# EAGLE design Arduino_DUE_X_V02d-2Layer (EAGLE 7.1.0)
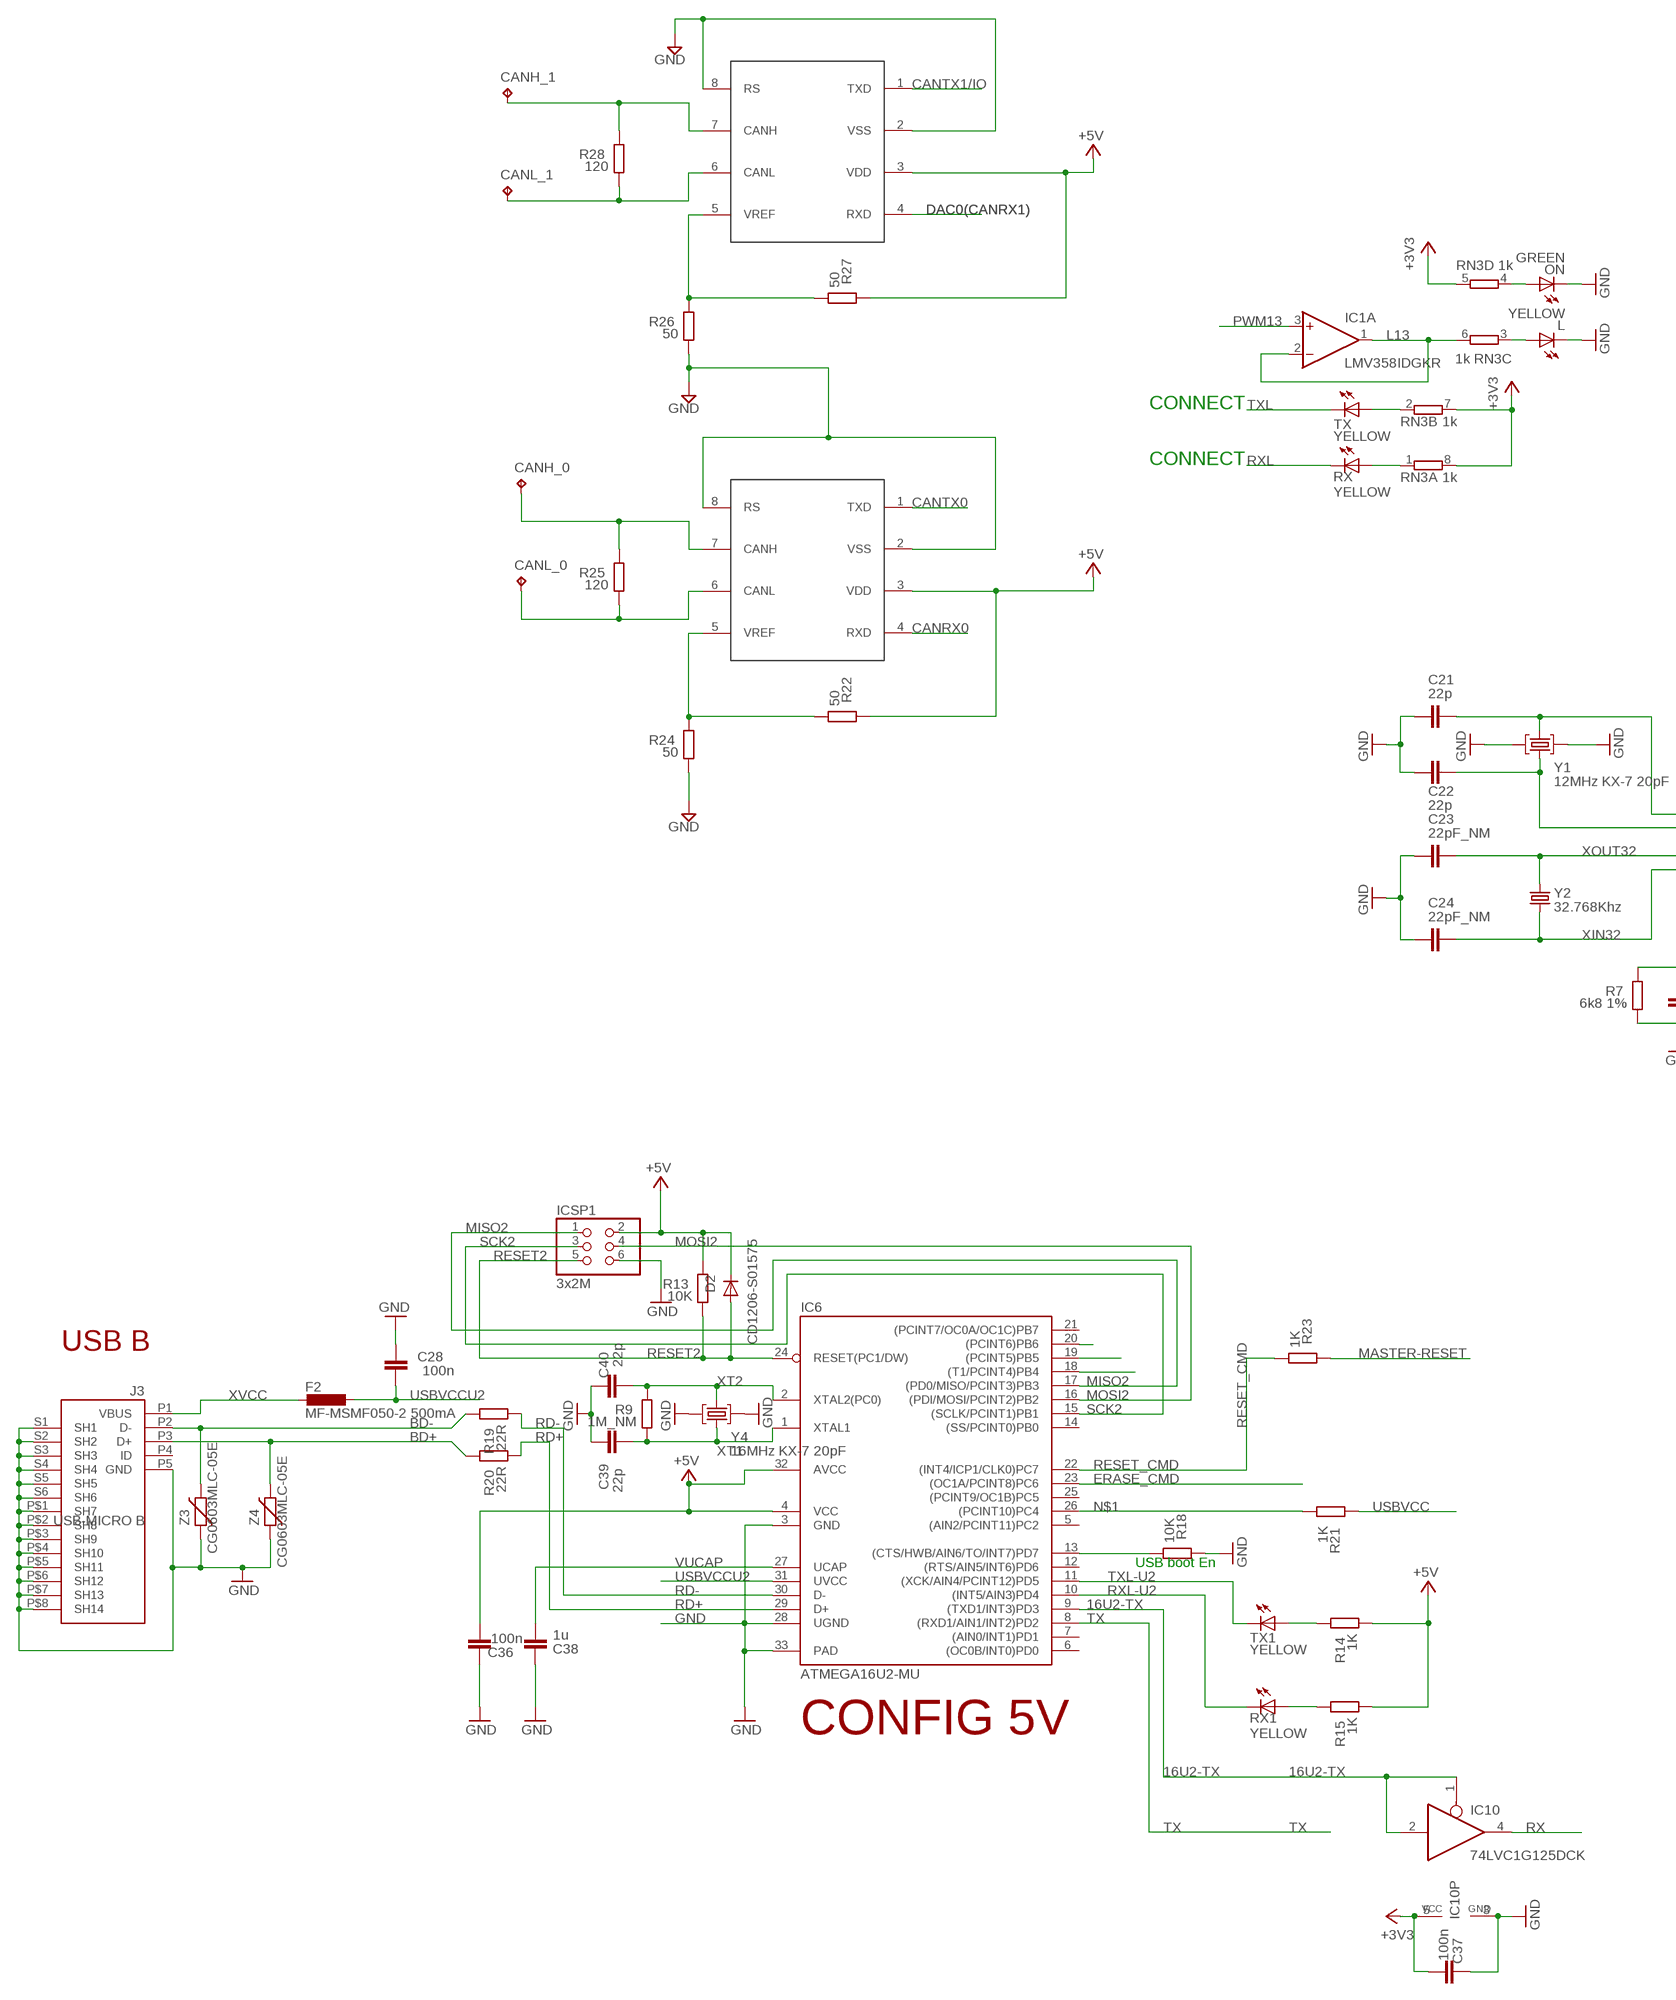
[diagram p0: schematic, sheet 1, part 1 of 2]
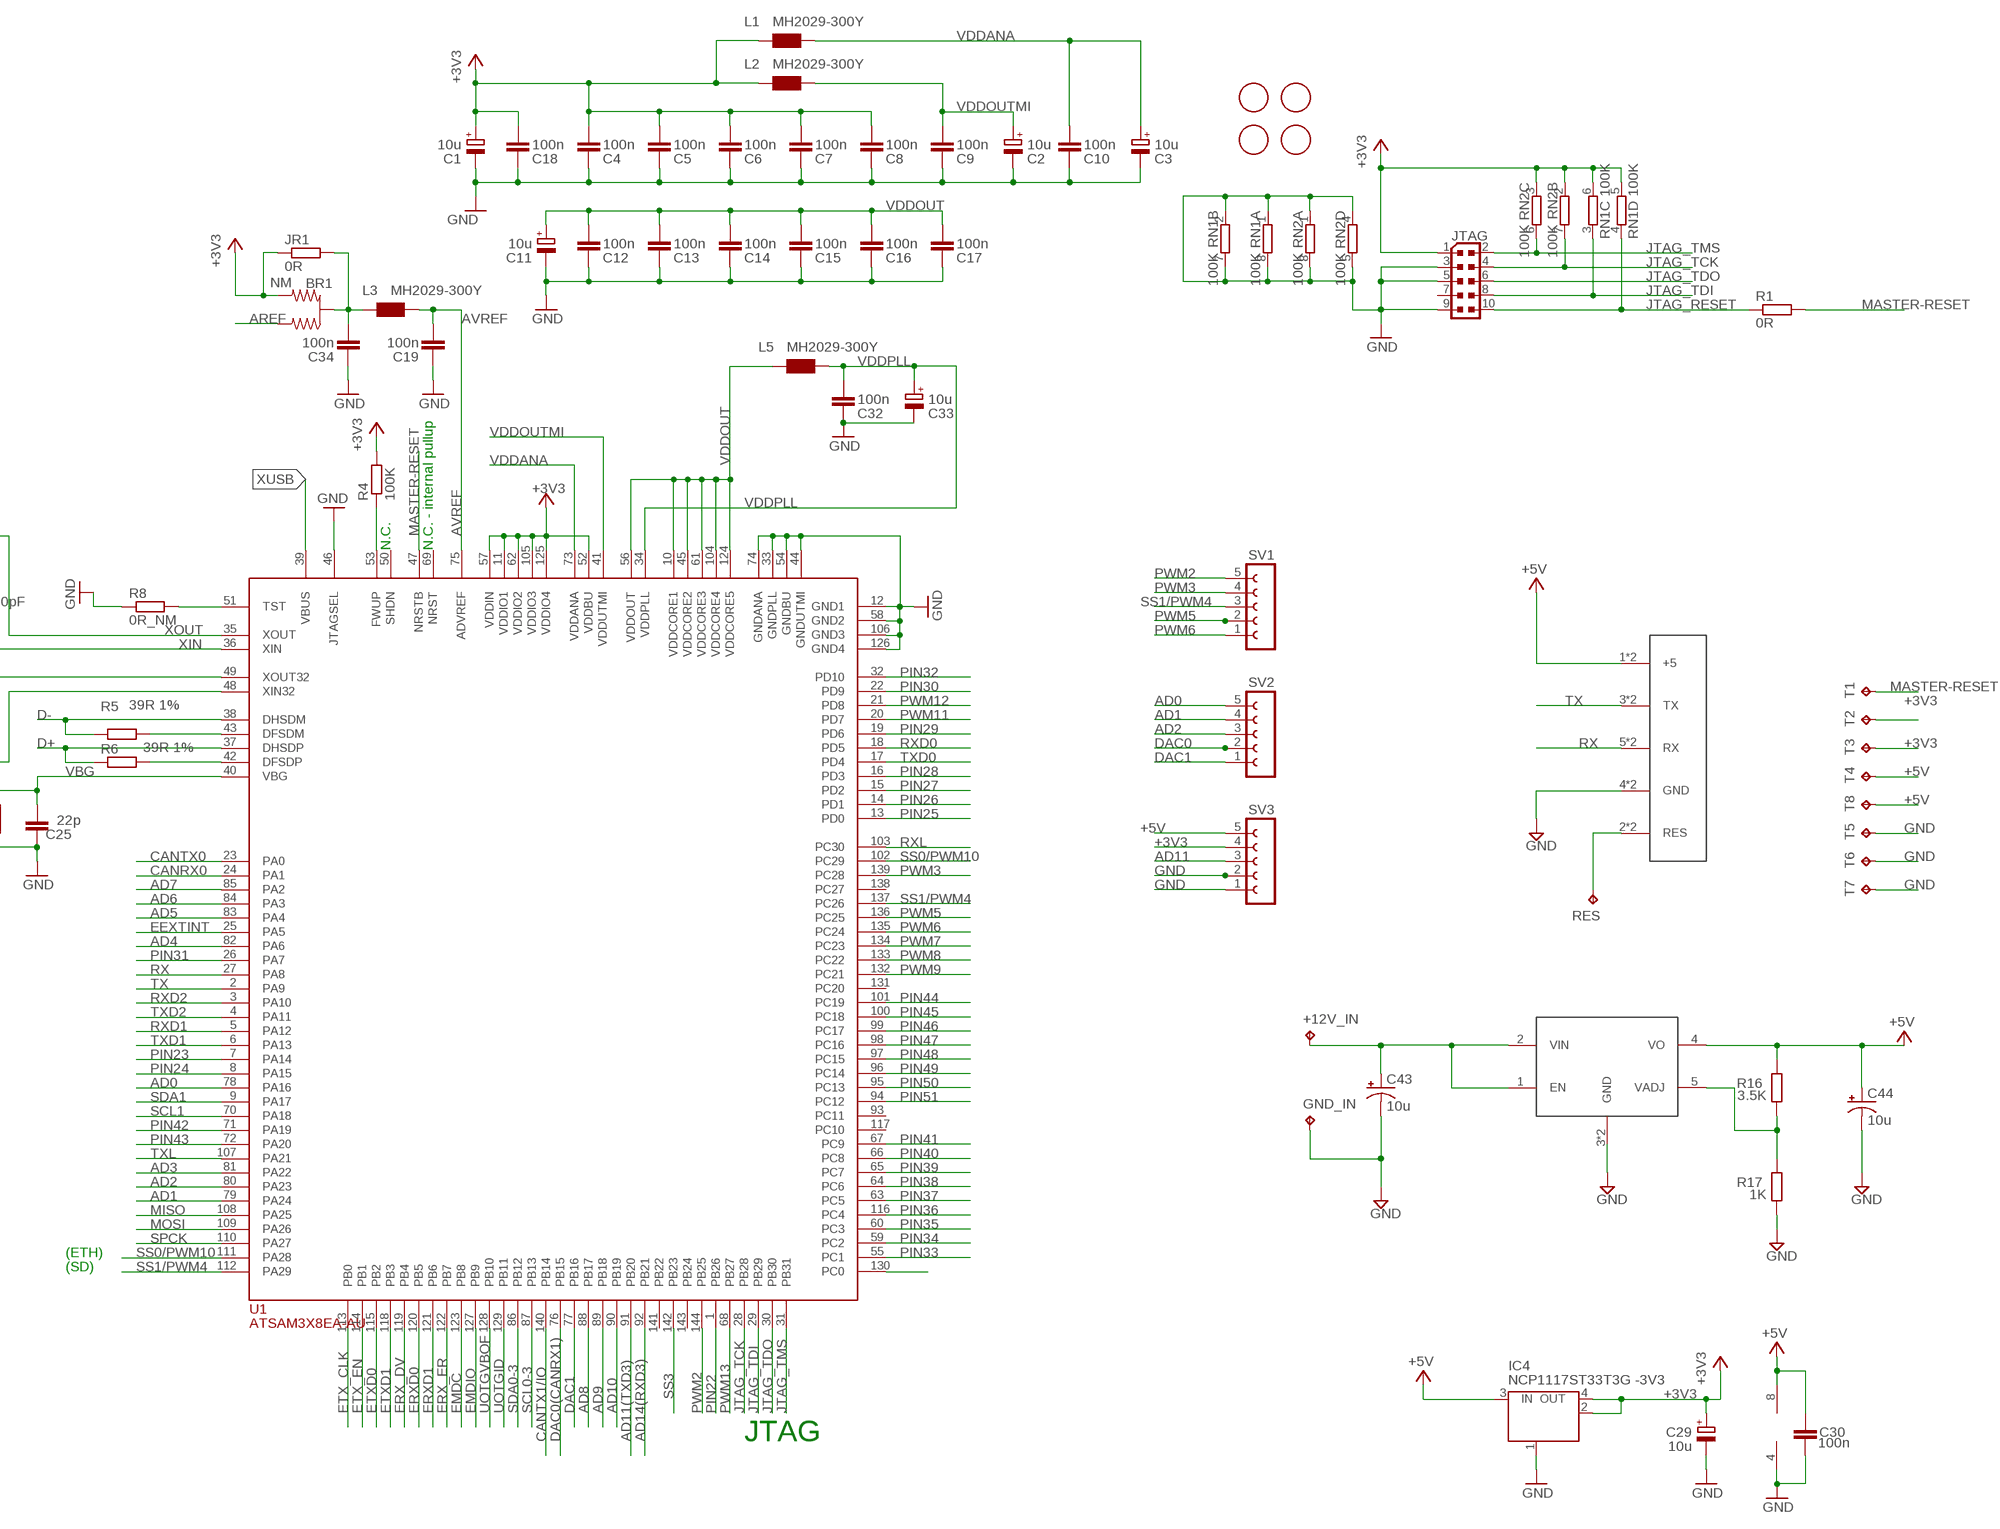
[diagram p1: schematic, sheet 1, part 2 of 2]

## Parts
+12V_IN  TPPAD1-13  [P1-13]
BR1  NM  J0402  [J0402]
C1  10u  CPOL-EUSMCB  [SMC_B]
C2  10u  CPOL-EUSMCB  [SMC_B]
C3  10u  CPOL-EUSMCB  [SMC_B]
C4  100n  C-EUC0805  [C0805]
C5  100n  C-EUC0805  [C0805]
C6  100n  C-EUC0805  [C0805]
C7  100n  C-EUC0805  [C0805]
C8  100n  C-EUC0805  [C0805]
C9  100n  C-EUC0805  [C0805]
C10  100n  C-EUC0805  [C0805]
C11  10u  CPOL-EUSMCB  [SMC_B]
C12  100n  C-EUC0805  [C0805]
C13  100n  C-EUC0805  [C0805]
C14  100n  C-EUC0805  [C0805]
C15  100n  C-EUC0805  [C0805]
C16  100n  C-EUC0805  [C0805]
C17  100n  C-EUC0805  [C0805]
C18  100n  C-EUC0805  [C0805]
C19  100n  C-EUC0805  [C0805]
C21  22p  C-EUC0805  [C0805]
C22  22p  C-EUC0805  [C0805]
C23  22pF_NM  C-EUC0805  [C0805]
C24  22pF_NM  C-EUC0805  [C0805]
C25  22p  C-EUC0805  [C0805]
C28  100n  C-EUC0805  [C0805]
C29  10u  CPOL-EUSMCB  [SMC_B]
C30  100n  C-EUC0805  [C0805]
C32  100n  C-EUC0805  [C0805]
C33  10u  CPOL-EUSMCB  [SMC_B]
C34  100n  C-EUC0805  [C0805]
C36  100n  C-EUC0805  [C0805]
C37  100n  C-EUC0805  [C0805]
C38  1u  C-EUC0805  [C0805]
C39  22p  C-EUC0805  [C0805]
C40  22p  C-EUC0805  [C0805]
C43  10u  CPOL-US153CLV-0405  [153CLV-0405]
C44  10u  CPOL-US153CLV-0405  [153CLV-0405]
CANH_0  TPPAD1-13  [P1-13]
CANH_1  TPPAD1-13  [P1-13]
CANL_0  TPPAD1-13  [P1-13]
CANL_1  TPPAD1-13  [P1-13]
D2  CD1206-S01575  DIODE-MINIMELF  [MINIMELF]
F2  MF-MSMF050-2 500mA  L-EUL1812  [L1812]
FID1  FIDUCIALMOUNT  [FIDUCIA-MOUNT]
FID2  FIDUCIALMOUNT  [FIDUCIA-MOUNT]
FID3  FIDUCIALMOUNT  [FIDUCIA-MOUNT]
FID4  FIDUCIALMOUNT  [FIDUCIA-MOUNT]
GND_IN  TPPAD1-13  [P1-13]
IC1  LMV358IDGKR  LMV358MMX  [MSOP08]
IC4  NCP1117ST33T3G -3V3  MC33269ST-3.3T3  [SOT223]
IC6  ATMEGA16U2-MU  [MLF32]
IC10  74LVC1G125DCK  [SC70-5]
ICSP1  3x2M  PINHD-2X3  [2X03]
J3  USB-MICRO B  MYCON2_USB-MINI-B  [CON2_USB_MICRO_B_AT]
JR1  0R  R-EU_R0805  [R0805]
JTAG  PINHEAD_PINHD-2X5PASSO127  [PINHEAD_2X05_127]
L  YELLOW  LEDCHIP-LED0805  [CHIP-LED0805]
L1  MH2029-300Y  WE-CBF_0805  [0805]
L2  MH2029-300Y  WE-CBF_0805  [0805]
L3  MH2029-300Y  WE-CBF_0805  [0805]
L5  MH2029-300Y  WE-CBF_0805  [0805]
ON  GREEN  LEDCHIP-LED0805  [CHIP-LED0805]
R1  0R  R-EU_R0805  [R0805]
R4  100K  R-EU_R0805  [R0805]
R5  39R 1%  R-EU_R0805  [R0805]
R6  39R 1%  R-EU_R0805  [R0805]
R7  6k8 1%  R-EU_R0805  [R0805]
R8  0R_NM  R-EU_R0805  [R0805]
R9  1M_NM  R-EU_R0805  [R0805]
R13  10K  R-EU_R0805  [R0805]
R14  1K  R-EU_R0805  [R0805]
R15  1K  R-EU_R0805  [R0805]
R16  3.5K  R-EU_R0805  [R0805]
R17  1K  R-EU_R0805  [R0805]
R18  10K  R-EU_R0805  [R0805]
R19  22R  R-EU_R0805  [R0805]
R20  22R  R-EU_R0805  [R0805]
R21  1K  R-EU_R0805  [R0805]
R22  50  R-EU_R0805  [R0805]
R23  1K  R-EU_R0805  [R0805]
R24  50  R-EU_R0805  [R0805]
R25  120  R-EU_R0805  [R0805]
R26  50  R-EU_R0805  [R0805]
R27  50  R-EU_R0805  [R0805]
R28  120  R-EU_R0805  [R0805]
RES  TPB1,27  [B1,27]
RN1  100K  4R-NCAT16  [CAT16]
RN2  100K  4R-NCAT16  [CAT16]
RN3  1k  4R-NCAY16  [CAY16]
RX  YELLOW  LEDCHIP-LED0805  [CHIP-LED0805]
RX1  YELLOW  LEDCHIP-LED0805  [CHIP-LED0805]
SV1  FE05-1  [FE05-1]
SV2  FE05-1  [FE05-1]
SV3  FE05-1  [FE05-1]
T1  TPB1,27  [B1,27]
T2  TPTP10R  [TP10R]
T3  TPB1,27  [B1,27]
T4  TPB1,27  [B1,27]
T5  TPB1,27  [B1,27]
T6  TPTP20SQ  [TP20SQ]
T7  TPTP20SQ  [TP20SQ]
T8  TPB1,27  [B1,27]
TX  YELLOW  LEDCHIP-LED0805  [CHIP-LED0805]
TX1  YELLOW  LEDCHIP-LED0805  [CHIP-LED0805]
U1  ATSAM3X8EA-AU  ATSAM3X/AAU  [LQFP144]
U2  MCP2551  [SOIC8]
U3  LCD_DISPLAY  [FE05-2]
U4  MCP2551  [SOIC8]
U$1  TLF1963TBATMA1  TLF1963  [DPAK]
Y1  12MHz KX-7 20pF  CRYSTAL-3.2-2.5  [CRYSTAL-3.2-2.5]
Y2  32.768Khz  RESONATOR_EPSON_FC_145  [RESONATOR_EPSON_FC_145]
Y4  16MHz KX-7 20pF  CRYSTAL-3.2-2.5  [CRYSTAL-3.2-2.5]
Z3  CG0603MLC-05E  VARISTORCN0805  [CT/CN0805]
Z4  CG0603MLC-05E  VARISTORCN0805  [CT/CN0805]

## Nets
8PB4: IC6.18((T1/PCINT4)PB4)
8PB5: IC6.19((PCINT5)PB5)
8PB6: IC6.20((PCINT6)PB6)
16U2-TX: IC6.9((TXD1/INT3)PD3) IC10.1(OE) IC10.2(I)
+3V3: BR1.3 C1.+ C4.2 C5.2 C6.2 C7.2 C8.2 C18.2 C29.+ C37.1 IC4.2(OUT) IC4.4(OUT) IC10.5(VCC) JR1.1 JTAG.1 L1.1 L2.1 R4.2 RN1.5 RN1.6 RN2.2 RN2.3 RN3.5 RN3.7 RN3.8 SV3.4 T2.TP T3.TP U1.11(VDDIO1) U1.52(VDDBU) U1.57(VDDIN) U1.62(VDDIO2) U1.105(VDDIO3) U1.125(VDDIO4)
+5V: C30.2 C36.1 C44.+ D2.C IC1.8(P:V+) IC4.3(IN) IC6.4(VCC) IC6.32(AVCC) ICSP1.2 R13.2 R14.1 R15.1 R16.2 R22.2 R27.2 SV3.5 T4.TP T8.TP U2.3(VDD) U3.1(+5) U3.10(+5) U4.3(VDD) U$1.4(VO)
AD0: SV2.5 U1.78(PA16)
AD1: SV2.4 U1.79(PA24)
AD2: SV2.3 U1.80(PA23)
AD3: U1.81(PA22)
AD4: U1.82(PA6)
AD5: U1.83(PA4)
AD6: U1.84(PA3)
AD7: U1.85(PA2)
AD8: U1.88(PB17)
AD9: U1.89(PB18)
AD10: U1.90(PB19)
AD11: SV3.3
AD11(TXD3): U1.91(PB20)
AD14(RXD3): U1.92(PB21)
AREF: BR1.1
AVREF: C19.2 L3.2 U1.75(ADVREF)
AVREFL: BR1.2(C) C34.2 JR1.2 L3.1
BD+ [USB]: J3.P3(D+) R20.2 Z4.2
BD- [USB]: J3.P2(D-) R19.2 Z3.2
CANRX0: U1.24(PA1) U4.4(RXD)
CANTX0: U1.23(PA0) U4.1(TXD)
CANTX1/IO: U1.140(PB14) U2.1(TXD)
D+ [USBpair]: R6.1 U1.37(DHSDP)
D- [USBpair]: R5.1 U1.38(DHSDM)
DAC0: SV2.2
DAC0(CANRX1): U1.76(PB15) U2.4(RXD)
DAC1: SV2.1 U1.77(PB16)
DTR: IC6.13((CTS/HWB/AIN6/TO/INT7)PD7) R18.1
EEXTINT: U1.25(PA5)
EMDC: U1.123(PB8)
EMDIO: U1.127(PB9)
ERASE_CMD: IC6.23((OC1A/PCINT8)PC6)
ERASE_S: U1.130(PC0)
ERX_DV: U1.119(PB4)
ERX_ER: U1.122(PB7)
ERXD0: U1.120(PB5)
ERXD1: U1.121(PB6)
ETX_CLK: U1.113(PB0)
ETX_EN: U1.114(PB1)
ETXD0: U1.115(PB2)
ETXD1: U1.118(PB3)
GND: C1.- C2.- C3.- C4.1 C5.1 C6.1 C7.1 C8.1 C9.1 C10.1 C11.- C12.1 C13.1 C14.1 C15.1 C16.1 C17.1 C18.1 C19.1 C21.2 C22.2 C23.2 C24.2 C25.2 C28.2 C29.- C30.1 C32.1 C33.- C34.1 C36.2 C37.2 C38.2 C39.2 C40.2 C43.- C44.- GND_IN.TP IC1.4(P:V-) IC4.1(GND/ADJ) IC6.3(GND) IC6.28(UGND) IC6.33(PAD) IC10.3(GND) ICSP1.6 J3.P5(GND) J3.P$1(SH7) J3.P$2(SH8) J3.P$3(SH9) J3.P$4(SH10) J3.P$5(SH11) J3.P$6(SH12) J3.P$7(SH13) J3.P$8(SH14) J3.S1(SH1) J3.S2(SH2) J3.S3(SH3) J3.S4(SH4) J3.S5(SH5) J3.S6(SH6) JTAG.3 JTAG.5 JTAG.9 L.C ON.C R7.1 R8.1 R17.1 R18.2 R24.1 R26.1 RN1.1 RN1.2 RN1.7 RN1.8 RN2.1 RN2.4 RN2.5 RN2.8 SV3.1 SV3.2 T5.TP T6.TP T7.TP U1.12(GND1) U1.33(GNDPLL) U1.44(GNDUTMI) U1.46(JTAGSEL) U1.54(GNDBU) U1.58(GND2) U1.74(GNDANA) U1.106(GND3) U1.126(GND4) U2.2(VSS) U2.8(RS) U3.4(GND) U3.7(GND) U4.2(VSS) U4.8(RS) U$1.3(GND) U$1.6(GND) Y1.2(GND) Y1.4(GND) Y4.2(GND) Y4.4(GND) Z3.1 Z4.1
JTAG_RESET: JTAG.10 R1.1 RN1.4
JTAG_TCK: JTAG.4 RN2.7 U1.28(PB28)
JTAG_TDI: JTAG.8 RN1.3 U1.29(PB29)
JTAG_TDO: JTAG.6 U1.30(PB30)
JTAG_TMS: JTAG.2 RN2.6 U1.31(PB31)
L13: IC1.1(A:OUT) IC1.2(A:-IN) RN3.6
MASTER-RESET: R1.2 R23.2 T1.TP U1.47(NRSTB)
MISO: U1.108(PA25)
MISO2: IC6.17((PD0/MISO/PCINT3)PB3) ICSP1.1
MOSI: U1.109(PA26)
MOSI2: IC6.16((PDI/MOSI/PCINT2)PB2) ICSP1.4
N$1: IC6.26((PCINT10)PC4) R21.1
N$2: L.A RN3.3
N$3: ON.A RN3.4
N$4: R15.2 RX1.A
N$5: R8.2 U1.51(TST)
N$7: R4.1 U1.53(FWUP)
N$11: R5.2 U1.43(DFSDM)
N$12: R6.2 U1.42(DFSDP)
N$13: +12V_IN.TP C43.+ U$1.1(EN) U$1.2(VIN)
N$14: R14.2 TX1.A
N$15: R16.1 R17.2 U$1.5(VADJ)
N$16: R26.2 R27.1 U2.5(VREF)
N$17: R22.1 R24.2 U4.5(VREF)
N$18: CANH_0.TP R25.2 U4.7(CANH)
N$19: CANL_0.TP R25.1 U4.6(CANL)
N$20: RES.TP U3.2(RES) U3.9(RES)
N$21: CANH_1.TP R28.2 U2.7(CANH)
N$22: CANL_1.TP R28.1 U2.6(CANL)
N$54: RN3.1 RX.A
N$55: RN3.2 TX.A
PIN22: U1.1(PB26)
PIN23: U1.7(PA14)
PIN24: U1.8(PA15)
PIN25: U1.13(PD0)
PIN26: U1.14(PD1)
PIN27: U1.15(PD2)
PIN28: U1.16(PD3)
PIN29: U1.19(PD6)
PIN30: U1.22(PD9)
PIN31: U1.26(PA7)
PIN32: U1.32(PD10)
PIN33: U1.55(PC1)
PIN34: U1.59(PC2)
PIN35: U1.60(PC3)
PIN36: U1.116(PC4)
PIN37: U1.63(PC5)
PIN38: U1.64(PC6)
PIN39: U1.65(PC7)
PIN40: U1.66(PC8)
PIN41: U1.67(PC9)
PIN42: U1.71(PA19)
PIN43: U1.72(PA20)
PIN44: U1.101(PC19)
PIN45: U1.100(PC18)
PIN46: U1.99(PC17)
PIN47: U1.98(PC16)
PIN48: U1.97(PC15)
PIN49: U1.96(PC14)
PIN50: U1.95(PC13)
PIN51: U1.94(PC12)
PWM2: SV1.5 U1.144(PB25)
PWM3: SV1.4 U1.139(PC28)
PWM5: SV1.2 U1.136(PC25)
PWM6: SV1.1 U1.135(PC24)
PWM7: U1.134(PC23)
PWM8: U1.133(PC22)
PWM9: U1.132(PC21)
PWM11: U1.20(PD7)
PWM12: U1.21(PD8)
PWM13: IC1.3(A:+IN) U1.68(PB27)
RD+: IC6.29(D+) R20.1
RD-: IC6.30(D-) R19.1
RESET2: D2.A IC6.24(RESET(PC1/DW)) ICSP1.5 R13.1
RESET_CMD: IC6.22((INT4/ICP1/CLK0)PC7) R23.1
RX: IC10.4(O) U1.27(PA8) U3.5(RX) U3.6(RX)
RXD0: U1.18(PD5)
RXD1: U1.5(PA12)
RXD2: U1.3(PA10)
RXL: RX.C U1.103(PC30)
RXL-U2: IC6.10((INT5/AIN3)PD4) RX1.C
SCK2: IC6.15((SCLK/PCINT1)PB1) ICSP1.3
SCL0-3: U1.87(PB13)
SCL1: U1.70(PA18)
SDA0-3: U1.86(PB12)
SDA1: U1.9(PA17)
SPCK: U1.110(PA27)
SS0/PWM10: U1.102(PC29) U1.111(PA28)
SS1/PWM4: SV1.3 U1.112(PA29) U1.137(PC26)
SS3: U1.142(PB23)
TX: IC6.8((RXD1/AIN1/INT2)PD2) U1.2(PA9) U3.3(TX) U3.8(TX)
TXD0: U1.17(PD4)
TXD1: U1.6(PA13)
TXD2: U1.4(PA11)
TXL: TX.C U1.107(PA21)
TXL-U2: IC6.11((XCK/AIN4/PCINT12)PD5) TX1.C
UOTGID: U1.129(PB11)
UOTGVBOF: U1.128(PB10)
USBVCC: R21.2
USBVCCU2: C28.1 F2.1 IC6.31(UVCC)
VBG: C25.1 R7.2 U1.40(VBG)
VDDANA: C3.+ C10.2 L1.2 U1.73(VDDANA)
VDDOUT: C11.+ C12.2 C13.2 C14.2 C15.2 C16.2 C17.2 L5.1 U1.10(VDDCORE1) U1.45(VDDCORE2) U1.56(VDDOUT) U1.61(VDDCORE3) U1.104(VDDCORE4) U1.124(VDDCORE5)
VDDOUTMI: C2.+ C9.2 L2.2 U1.41(VDDUTMI)
VDDPLL: C32.2 C33.+ L5.2 U1.34(VDDPLL)
VUCAP: C38.1 IC6.27(UCAP)
XIN: C22.1 U1.36(XIN) Y1.1(C1)
XIN32: C24.1 U1.48(XIN32) Y2.P$2
XOUT: C21.1 U1.35(XOUT) Y1.3(C2)
XOUT32: C23.1 U1.49(XOUT32) Y2.P$1
XT1: C39.1 IC6.1(XTAL1) R9.1 Y4.1(C1)
XT2: C40.1 IC6.2(XTAL2(PC0)) R9.2 Y4.3(C2)
XUSB [usbvcc]: U1.39(VBUS)
XVCC [usbvcc]: F2.2 J3.P1(VBUS)
Unconnected: IC1.5(B:+IN) IC1.6(B:-IN) IC1.7(B:OUT) IC6.5((AIN2/PCINT11)PC2) IC6.6((OC0B/INT0)PD0) IC6.7((AIN0/INT1)PD1) IC6.12((RTS/AIN5/INT6)PD6) IC6.14((SS/PCINT0)PB0) IC6.21((PCINT7/OC0A/OC1C)PB7) IC6.25((PCINT9/OC1B)PC5) J3.P4(ID) JTAG.7 U1.50(SHDN) U1.69(NRST) U1.93(PC11) U1.117(PC10) U1.131(PC20) U1.138(PC27) U1.141(PB22) U1.143(PB24)

## Notes on the sheet
- CONNECT
- CONNECT
- N.C. | N.C. - internal pullup
- USB B
- (ETH)
- (SD)
- USB boot En
- JTAG
- CONFIG 5V

## Library data of the parts
+12V_IN CANH_0 CANH_1 CANL_0 CANL_1 GND_IN RES T1-T8 = testpad:TP: Test pad
BR1 = bibaja:J: Three terminal jumper made from two 0402, 0603, 0805, etc.
C1-C3 C11 C29 C33 = rcl:CPOL-EU: POLARIZED CAPACITOR, European symbol
C4-C10 C12-C19 C21-C25 C28 C30 C32 C34 C36-C40 = SmartPrj:C-EU: CAPACITOR, European symbol
C43 C44 = Dash parts:CPOL-US: POLARIZED CAPACITOR, American symbol; EEE-FPV100UAR: 10u
D2 = diode:DIODE-: DIODE
F2 = rcl:L-EU: INDUCTOR, European symbol
FID1-FID4 = SmartPrj:FIDUCIALMOUNT
IC1 = linear:LMV358?*: Dual General Purpose, Low Voltage, Rail-to-Rail Output Operational Amplifiers Source: http://www.national.com/mpf/LM/LMV321.html http://www.national.com/dt/lmv_qual.pdf
IC4 = linear:MC33269ST*: Adjustable Output Low Dropout Voltage Regulator 800 mA Source: http://www.onsemi.com/pub/Collateral/MC33269-D.PDF
IC6 = SmartPrj:ATMEGA16U2-
IC10 = 74xx-little-us:74*1G125: Single Bus Buffer Gate with 3-State Output
ICSP1 = SmartPrj:PINHD-2X3: PIN HEADER
J3 = SmartPrj:MYCON2_USB-MINI-B
JR1 R1 R4-R9 R13-R15 R18-R28 = SmartPrj:R-EU_: RESISTOR, European symbol
JTAG = Arduino_Wifi_shield_v018_tG:PINHEAD_PINHD-2X5: PIN HEADER
L ON RX RX1 TX TX1 = led:LED: LED OSRAM: - CHIPLED LG R971, LG N971, LY N971, LG Q971, LY Q971, LO R971, LY R971 LH N974, LH R974 LS Q976, LO Q976, LY Q976 LO Q996 - Hyper CHIPLED LW Q18S LB Q993, LB Q99A, LB R99A - SideLED LS A670, LO A670, LY A670, LG A670, LP A670 LB A673, LV A673, LT A673, LW A673 LH A674 LY A675 LS A676, LA A676, LO A676, LY A676, LW A676 LS A679, LY A679, LG A679 - Hyper Micro SIDELED® LS Y876, LA Y876, LO Y876, LY Y876 LT Y87S - SmartLED LW L88C, LW L88S LB L89C, LB L89S, LG L890 LS L89K, LO L89K, LY L89K LS L896, LA L896, LO L896, LY L896 - TOPLED LS T670, LO T670, LY T670, LG T670, LP T670 LSG T670, LSP T670, LSY T670, LOP T670, LYG T670 LG T671, LOG T671, LSG T671 LB T673, LV T673, LT T673, LW T673 LH T674 LS T676, LA T676, LO T676, LY T676, LB T676, LH T676, LSB T676, LW T676 LB T67C, LV T67C, LT T67C, LS T67K, LO T67K, LY T67K, LW E67C LS E67B, LA E67B, LO E67B, LY E67B, LB E67C, LV E67C, LT E67C LW T67C LS T679, LY T679, LG T679 LS T770, LO T770, LY T770, LG T770, LP T770 LB T773, LV T773, LT T773, LW T773 LH T774 LS E675, LA E675, LY E675, LS T675 LS T776, LA T776, LO T776, LY T776, LB T776 LHGB T686 LT T68C, LB T68C - Hyper Mini TOPLED® LB M676 - Mini TOPLED Santana® LG M470 LS M47K, LO M47K, LY M47K Source: http://www.osram.convergy.de LUXEON: - LUMILED® LXK2-PW12-R00, LXK2-PW12-S00, LXK2-PW14-U00, LXK2-PW14-V00 LXK2-PM12-R00, LXK2-PM12-S00, LXK2-PM14-U00 LXK2-PE12-Q00, LXK2-PE12-R00, LXK2-PE12-S00, LXK2-PE14-T00, LXK2-PE14-U00 LXK2-PB12-K00, LXK2-PB12-L00, LXK2-PB12-M00, LXK2-PB14-N00, LXK2-PB14-P00, LXK2-PB14-Q00 LXK2-PR12-L00, LXK2-PR12-M00, LXK2-PR14-Q00, LXK2-PR14-R00 LXK2-PD12-Q00, LXK2-PD12-R00, LXK2-PD12-S00 LXK2-PH12-R00, LXK2-PH12-S00 LXK2-PL12-P00, LXK2-PL12-Q00, LXK2-PL12-R00 Source: www.luxeon.com KINGBRIGHT: KA-3528ASYC Source: www.kingbright.com
L1-L3 L5 = wuerth-elektronik:WE-CBF: SMD EMI Suppression Ferrite Beads - excellent anti-EMI properties - low DCR - impedances till 3000 ohms - rated current up to 6 A
R16 = SmartPrj:R-EU_: RESISTOR, European symbol; SMD: 3.5K, 1%
R17 = SmartPrj:R-EU_: RESISTOR, European symbol; SMD: 1K, 1%
RN1-RN3 = resistor-dil:4R-N: Array Chip Resistor Source: RS Component / Phycomp; OC_FARNELL: unknown; OC_NEWARK: unknown
SV1-SV3 = con-lsta:FE05-1: FEMALE HEADER; OC_FARNELL: unknown; OC_NEWARK: unknown
U1 = SmartPrj:ATSAM3X/A
U2 U4 = Dash parts:MCP2551
U3 = Dash parts:LCD_DISPLAY
U$1 = Dash parts:TLF1963
Y1 Y4 = SmartPrj:CRYSTAL-3.2-2.5
Y2 = Arduino_Wifi_shield_v018_tG:RESONATOR_EPSON_FC_145
Z3 Z4 = varistor:VARISTOR: VARISTOR

## Net classes
1 USB: width 0.203 mm, drill 0.406 mm, clearance 0.203 mm
2 gnd: width 0.203 mm, drill 0.406 mm, clearance 0.203 mm
3 usbvcc: width 0.203 mm, drill 0.406 mm, clearance 0.203 mm
4 USBpair: width 0.254 mm, drill 0.406 mm, clearance 0.61 mm

## Board
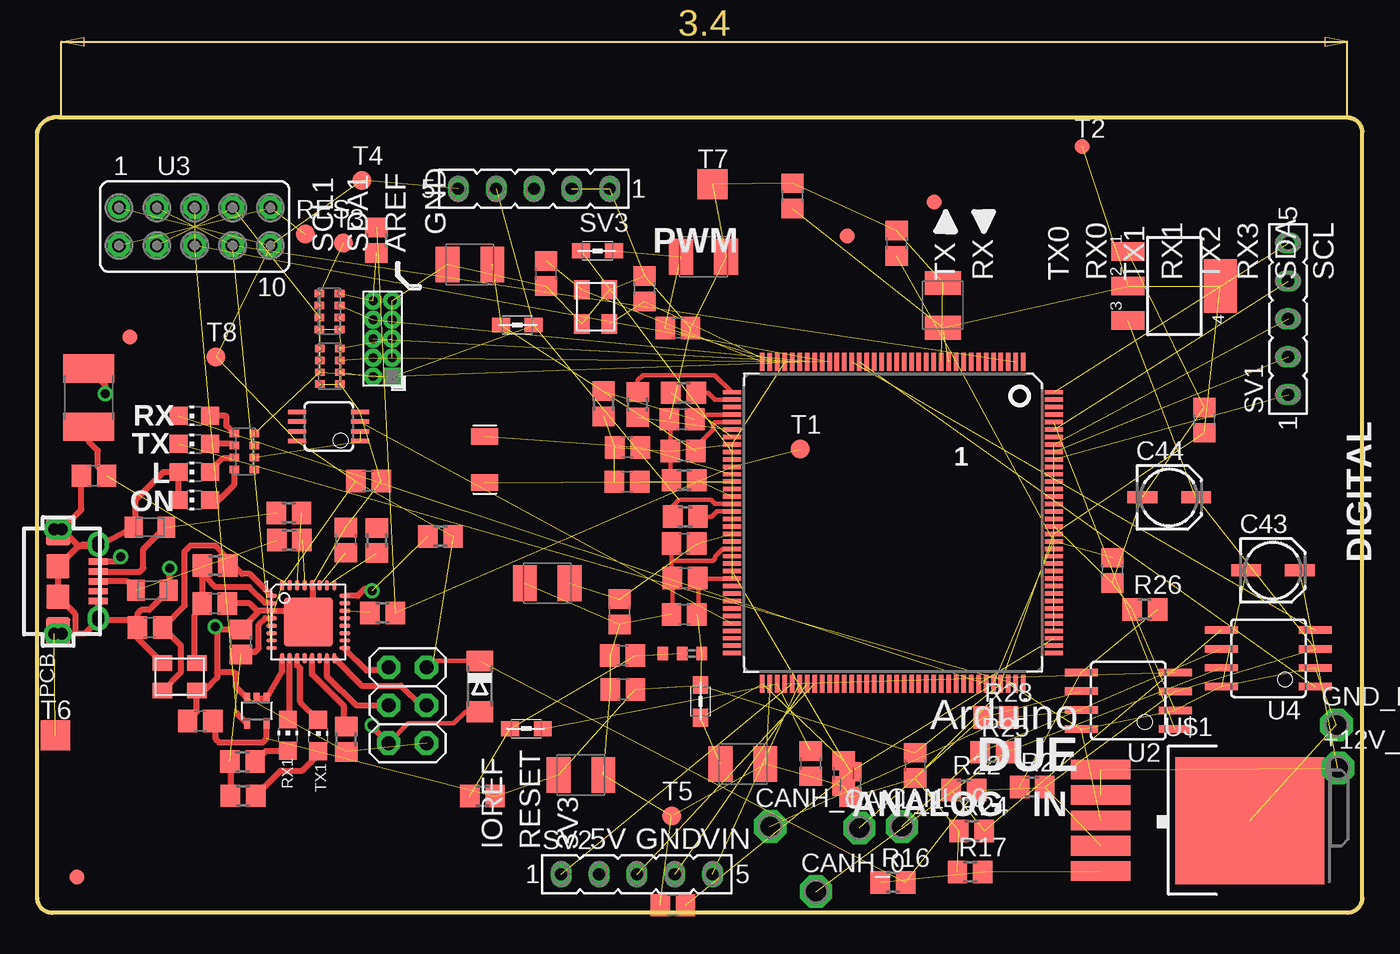
[diagram p2: board, top side]
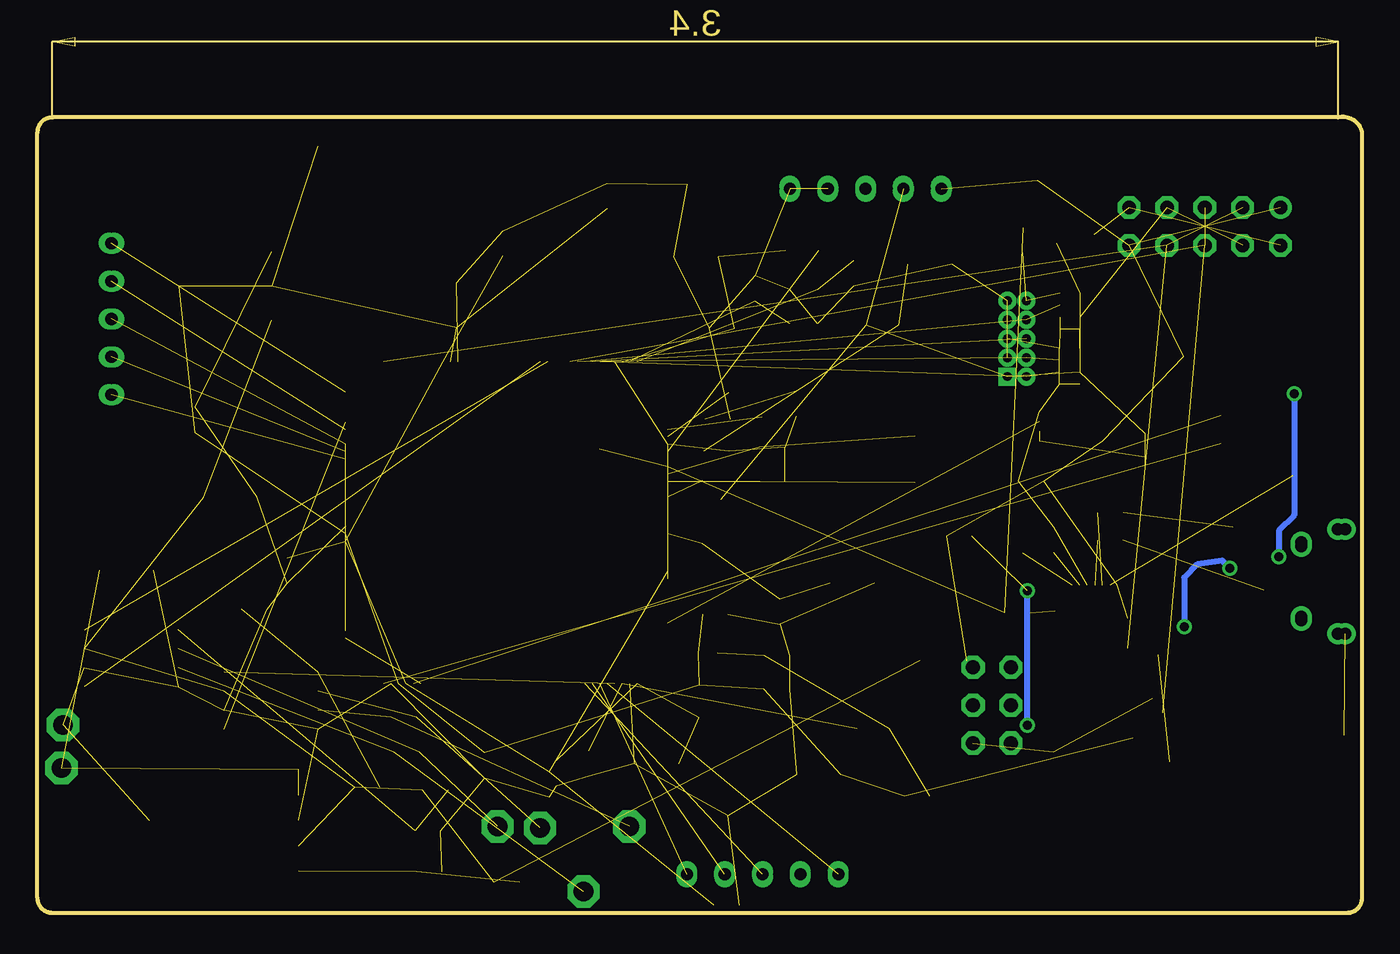
[diagram p3: board, bottom side, seen from below]

Size 88.9 x 53.37 mm. Coordinates in mm from the lower left corner, seen from the top.
Outline: 87.88,53.34 1.61,53.34 arc90 0,52.34 0,1 arc90 1,0 87.9,0 arc90 88.9,1 88.9,52.34 arc90 87.9,53.34
Copper layers (1*16): Top 0.035mm / dielectric 1.6mm / Bottom 0.035mm
Design rules "default *": minimum track width 8mil, minimum drill 16mil, track to track 8mil, track to pad 8mil, pad to pad 8mil, via to via 8mil, smd to smd 6mil, copper to edge 20mil, drill to drill 12mil, minimum pad ring 12mil, minimum via ring 8mil, stop-mask expansion 2mil, vias tented up to drill 25mil, thermal gap 8mil
tRestrict: 5 lines
bRestrict: 5 lines

### Footprints (pad centres in the part's own frame; a part is rotated, then mirrored left to right if it is on the bottom)
P1-13 = drill 1.321 pad 2.159 octagon: TP 0,0
J0402 = smd 0.7 x 0.9: 1 -0.65,0; 2 0.65,0; 3 1.95,0
SMC_B = smd 1.6 x 2.4: + -1.5,0; - 1.5,0
C0805 = smd 1.3 x 1.5: 1 -0.85,0; 2 0.85,0
153CLV-0405 = smd 2 x 0.8: + 1.8,0; - -1.8,0
MINIMELF = smd 1.4 x 1.8: A 1.7,0; C -1.7,0
L1812 = smd 1.9 x 3.4: 1 -1.95,0; 2 1.95,0
FIDUCIA-MOUNT = smd 1.016 x 1.016: P$1 0,0
MSOP08 = smd 0.3 x 1.2: 1 -0.976,-2.113; 2 -0.326,-2.113; 3 0.324,-2.113; 4 0.974,-2.113; 5 0.974,2.112; 6 0.324,2.112; 7 -0.326,2.112; 8 -0.976,2.112
SOT223 = smd 1.219 x 2.235: 1 -2.311,-3.099; 2 0,-3.099; 3 2.311,-3.099 | smd 3.6 x 2.2: 4 0,3.099
MLF32 = smd 0.7 x 0.28: 1 -2.45,1.75; 2 -2.45,1.25; 3 -2.45,0.75; 4 -2.45,0.25; 5 -2.45,-0.25; 6 -2.45,-0.75; 7 -2.45,-1.25; 8 -2.45,-1.75; 17 2.45,-1.75; 18 2.45,-1.25; 19 2.45,-0.75; 20 2.45,-0.25; 21 2.45,0.25; 22 2.45,0.75; 23 2.45,1.25; 24 2.45,1.75 | smd 0.28 x 0.7: 9 -1.75,-2.45; 10 -1.25,-2.45; 11 -0.75,-2.45; 12 -0.25,-2.45; 13 0.25,-2.45; 14 0.75,-2.45; 15 1.25,-2.45; 16 1.75,-2.45; 25 1.75,2.45; 26 1.25,2.45; 27 0.75,2.45; 28 0.25,2.45; 29 -0.25,2.45; 30 -0.75,2.45; 31 -1.25,2.45; 32 -1.75,2.45 | smd 3.254 x 3.254: 33 0,0
SC70-5 = smd 0.4 x 0.7: 1 -0.65,-0.85; 2 0,-0.85; 3 0.65,-0.85; 4 0.65,0.85; 5 -0.65,0.85
2X03 = drill 0.95 pad 1.55 octagon: 1 -2.54,-1.27; 2 -2.54,1.27; 3 0,-1.27; 4 0,1.27; 5 2.54,-1.27; 6 2.54,1.27
CON2_USB_MICRO_B_AT = smd 0.406 x 1.346: P1 -1.321,2.692; P2 -0.66,2.692; P3 0,2.692; P4 0.66,2.692; P5 1.321,2.692 | drill 0.8 pad 1.27: P$1 -2.616,2.692 | drill 0.8 pad 1.245: P$2 -2.362,2.692; P$7 2.362,2.692; P$8 2.616,2.692 | drill 0.8 pad 1.143: P$3 -3.505,-0.254; P$4 -3.505,0.254; P$5 3.505,0.254; P$6 3.505,-0.254 | smd 1.778 x 1.651: S1 -3.302,0; S2 3.302,0 | smd 1.524 x 1.27: S3 -2.489,2.692; S4 2.489,2.692 | smd 1.626 x 1.524: S5 -1.016,0; S6 1.016,0
R0805 = smd 1.3 x 1.5: 1 -0.85,0; 2 0.85,0
PINHEAD_2X05_127 = drill 0.6 pad 1.016 square: 1 -0.635,2.54 | drill 0.6 pad 1.016: 2 0.635,2.54; 3 -0.635,1.27; 4 0.635,1.27; 5 -0.635,0; 6 0.635,0; 7 -0.635,-1.27; 8 0.635,-1.27; 9 -0.635,-2.54; 10 0.635,-2.54
CHIP-LED0805 = smd 1.2 x 1.2: A 0,-1.05; C 0,1.05
0805 = smd 1.2 x 1: 1 -1.1,0; 2 1.1,0
B1,27 = smd 1.27 x 1.27: TP 0,0
CAT16 = smd 0.5 x 0.65: 1 -1.2,-0.675; 2 -0.4,-0.675; 3 0.4,-0.675; 4 1.2,-0.675; 5 1.2,0.675; 6 0.4,0.675; 7 -0.4,0.675; 8 -1.2,0.675
CAY16 = smd 0.5 x 0.65: 1 -1.2,-0.675; 2 -0.4,-0.675; 3 0.4,-0.675; 4 1.2,-0.675; 5 1.2,0.675; 6 0.4,0.675; 7 -0.4,0.675; 8 -1.2,0.675
FE05-1 = drill 0.813 long: 1 -5.08,0; 2 -2.54,0; 3 0,0; 4 2.54,0; 5 5.08,0
TP10R = smd 1 x 1: TP 0,0
TP20SQ = smd 2 x 2: TP 0,0
LQFP144 = smd 0.3 x 1.2: 1 -8.75,-10.8; 2 -8.25,-10.8; 3 -7.75,-10.8; 4 -7.25,-10.8; 5 -6.75,-10.8; 6 -6.25,-10.8; 7 -5.75,-10.8; 8 -5.25,-10.8; 9 -4.75,-10.8; 10 -4.25,-10.8; 11 -3.75,-10.8; 12 -3.25,-10.8; 13 -2.75,-10.8; 14 -2.25,-10.8; 15 -1.75,-10.8; 16 -1.25,-10.8; 17 -0.75,-10.8; 18 -0.25,-10.8; 19 0.25,-10.8; 20 0.75,-10.8; 21 1.25,-10.8; 22 1.75,-10.8; 23 2.25,-10.8; 24 2.75,-10.8; 25 3.25,-10.8; 26 3.75,-10.8; 27 4.25,-10.8; 28 4.75,-10.8; 29 5.25,-10.8; 30 5.75,-10.8; 31 6.25,-10.8; 32 6.75,-10.8; 33 7.25,-10.8; 34 7.75,-10.8; 35 8.25,-10.8; 36 8.75,-10.8; 73 8.75,10.8; 74 8.25,10.8; 75 7.75,10.8; 76 7.25,10.8; 77 6.75,10.8; 78 6.25,10.8; 79 5.75,10.8; 80 5.25,10.8; 81 4.75,10.8; 82 4.25,10.8; 83 3.75,10.8; 84 3.25,10.8; 85 2.75,10.8; 86 2.25,10.8; 87 1.75,10.8; 88 1.25,10.8; 89 0.75,10.8; 90 0.25,10.8; 91 -0.25,10.8; 92 -0.75,10.8; 93 -1.25,10.8; 94 -1.75,10.8; 95 -2.25,10.8; 96 -2.75,10.8; 97 -3.25,10.8; 98 -3.75,10.8; 99 -4.25,10.8; 100 -4.75,10.8; 101 -5.25,10.8; 102 -5.75,10.8; 103 -6.25,10.8; 104 -6.75,10.8; 105 -7.25,10.8; 106 -7.75,10.8; 107 -8.25,10.8; 108 -8.75,10.8 | smd 1.2 x 0.3: 37 10.8,-8.75; 38 10.8,-8.25; 39 10.8,-7.75; 40 10.8,-7.25; 41 10.8,-6.75; 42 10.8,-6.25; 43 10.8,-5.75; 44 10.8,-5.25; 45 10.8,-4.75; 46 10.8,-4.25; 47 10.8,-3.75; 48 10.8,-3.25; 49 10.8,-2.75; 50 10.8,-2.25; 51 10.8,-1.75; 52 10.8,-1.25; 53 10.8,-0.75; 54 10.8,-0.25; 55 10.8,0.25; 56 10.8,0.75; 57 10.8,1.25; 58 10.8,1.75; 59 10.8,2.25; 60 10.8,2.75; 61 10.8,3.25; 62 10.8,3.75; 63 10.8,4.25; 64 10.8,4.75; 65 10.8,5.25; 66 10.8,5.75; 67 10.8,6.25; 68 10.8,6.75; 69 10.8,7.25; 70 10.8,7.75; 71 10.8,8.25; 72 10.8,8.75; 109 -10.8,8.75; 110 -10.8,8.25; 111 -10.8,7.75; 112 -10.8,7.25; 113 -10.8,6.75; 114 -10.8,6.25; 115 -10.8,5.75; 116 -10.8,5.25; 117 -10.8,4.75; 118 -10.8,4.25; 119 -10.8,3.75; 120 -10.8,3.25; 121 -10.8,2.75; 122 -10.8,2.25; 123 -10.8,1.75; 124 -10.8,1.25; 125 -10.8,0.75; 126 -10.8,0.25; 127 -10.8,-0.25; 128 -10.8,-0.75; 129 -10.8,-1.25; 130 -10.8,-1.75; 131 -10.8,-2.25; 132 -10.8,-2.75; 133 -10.8,-3.25; 134 -10.8,-3.75; 135 -10.8,-4.25; 136 -10.8,-4.75; 137 -10.8,-5.25; 138 -10.8,-5.75; 139 -10.8,-6.25; 140 -10.8,-6.75; 141 -10.8,-7.25; 142 -10.8,-7.75; 143 -10.8,-8.25; 144 -10.8,-8.75
SOIC8 = smd 0.5 x 2.2: 1 -1.905,-3.154; 2 -0.645,-3.154; 3 0.625,-3.154; 4 1.895,-3.154; 5 1.905,3.154; 6 0.635,3.154; 7 -0.635,3.154; 8 -1.905,3.154
FE05-2 = drill 0.914: 1 -5.08,1.27 | drill 0.914 octagon: 2 -5.08,-1.27; 3 -2.54,1.27; 4 -2.54,-1.27; 5 0,1.27; 6 0,-1.27; 7 2.54,1.27; 8 2.54,-1.27; 9 5.08,1.27; 10 5.08,-1.27
DPAK = smd 1.31 x 4: 1 -2.28,-4.04; 2 -0.58,-4.04; 3 1.12,-4.04; 4 2.82,-4.04; 5 4.52,-4.04 | smd 8.5 x 10: 6 1.15,5.97
CRYSTAL-3.2-2.5 = smd 1.3 x 1.05: 1 -1.15,-0.925; 2 1.15,-0.925; 3 1.15,0.925; 4 -1.15,0.925
RESONATOR_EPSON_FC_145 = smd 1.1 x 1.8: P$1 -1.55,0; P$2 1.55,0
CT/CN0805 = smd 1.2 x 1.4: 1 -1.1,0; 2 1.1,0

### Placement (x,y rotation side)
+12V_IN  87.27,9.7 0 top
BR1  42.62,17.4 0 top
C1  36.47,9.25 0 top
C2  29.03,43.48 180 top
C3  47.35,9.98 0 top
C4  43.41,20.02 0 top
C5  50.67,48.08 270 top
C6  43.46,22.45 0 top
C7  58.9,9.88 90 top
C8  78.31,33.05 270 top
C9  43.33,30.96 0 top
C10  54.1,9.35 90 top
C11  34.21,22.1 180 top
C12  39.07,20.19 90 top
C13  57.66,44.91 270 top
C14  42.65,0.51 0 top
C15  43.41,24.77 0 top
C16  54.56,8.61 90 top
C17  72.14,22.96 90 top
C18  39.29,14.99 0 top
C19  51.89,10.01 90 top
C21  40.74,41.86 90 top
C22  34.14,42.88 270 top
C23  39.57,28.91 180 top
C24  39.6,31.22 180 top
C25  43.26,33.1 180 top
C28  3.81,29.31 180 top
C29  60.76,40.74 90 top
C30  22.23,28.96 180 top
C32  42.98,39.22 180 top
C33  44.7,43.99 0 top
C34  39.27,17.25 0 top
C36  13.67,18.16 90 top
C37  10.94,12.87 180 top
C38  20.7,24.99 90 top
C39  7.57,19.13 180 top
C40  11.91,20.75 0 top
C43  82.91,22.96 0 top
C44  75.95,27.86 0 top
CANH_0  52.25,1.42 0 top
CANH_1  49.17,5.79 0 top
CANL_0  58.01,5.79 0 top
CANL_1  55.17,5.69 0 top
D2  29.69,15.19 270 top
F2  3.45,34.54 90 top
FID1  54.36,45.38 0 top
FID2  60.17,47.68 0 top
FID3  6.22,38.61 0 top
FID4  2.67,2.41 0 top
GND_IN  87.17,12.6 0 top
IC1  19.56,32.61 90 top
IC4  76.28,42.04 270 top
IC6  18.19,19.51 0 top
IC10  14.73,13.54 180 top
ICSP1  24.84,13.92 270 top
J3  1.4,22.23 270 top
JR1  29.87,7.82 180 top
JTAG  23.16,38.51 180 top
L  10.54,29.57 90 top
L1  44.5,14.17 270 top
L2  32.21,39.42 180 top
L3  32.82,12.34 0 top
L5  37.59,44.4 0 top
ON  10.54,27.69 90 top
R1  22.76,45.11 90 top
R4  43.48,26.57 180 top
R5  43.36,34.87 180 top
R6  40.28,34.09 270 top
R7  38,34.14 90 top
R8  43.41,29.01 0 top
R9  11.94,23.29 180 top
R13  27.05,25.25 0 top
R14  13.82,7.85 0 top
R15  13.77,10.13 0 top
R16  57.4,2.03 0 top
R17  62.59,2.74 0 top
R18  20.73,11.63 270 top
R19  16.89,26.82 180 top
R20  16.92,24.99 180 top
R21  22.78,24.97 90 top
R22  62.18,8.23 0 top
R23  23.16,20.12 0 top
R24  62.69,5.49 0 top
R25  64.11,10.77 0 top
R26  74.32,20.35 0 top
R27  66.75,8.43 0 top
R28  64.31,13.11 0 top
RES  17.98,45.52 0 top
RN1  19.61,40.34 90 top
RN2  19.63,36.65 270 top
RN3  13.89,30.94 270 top
RX  10.54,33.32 90 top
RX1  16.81,11.91 0 top
SV1  83.92,39.83 90 top
SV2  40.23,2.59 0 top
SV3  33.32,48.56 180 top
T1  51.18,31.09 0 top
T2  70.1,51.41 0 top
T3  20.52,44.91 0 top
T4  21.79,49.12 0 top
T5  42.57,6.5 0 top
T6  1.22,11.91 0 top
T7  45.31,48.87 0 top
T8  11.99,37.29 0 top
TX  10.54,31.45 90 top
TX1  18.85,11.89 0 top
U1  57.4,26.16 180 top
U2  73.2,14.22 90 top
U3  10.57,46.02 0 top
U4  82.6,17.07 90 top
U$1  75.39,7.32 270 top
Y1  37.47,40.64 270 top
Y2  30.02,30.4 90 top
Y4  9.55,15.82 0 top
Z3  7.57,25.86 0 top
Z4  7.72,21.64 180 top

### Tracks (layer width: path | path; a pad name or v marks a point on that pad's centre or on a via)
16U2-TX
  Top 0.406: IC10.2 IC10.1 16.44,16.21 IC6.9
+3V3  (29 unrouted)
  Top 0.305: C6.2 44.35,22.41 | 44.35,22.41 U1.62 | 44.35,22.41 44.35,20.11 C4.2 | R4.2 42.63,27.27 43.05,27.69 45.21,27.69 45.47,27.43 46.58,27.43 U1.52
  Top 0.406: C37.1 11.94,12.72 11.94,11.68 12.19,11.43 15.11,11.43 15.38,11.7 IC10.5
+5V  (19 unrouted)
  Top 0.305: ICSP1.2 26.54,16.89 D2.C
  Top 0.406: C36.1 13.86,17.5 14.61,17.5 14.86,17.75 14.86,19.3 15.31,19.76 IC6.4 | R15.1 12.97,10.08 R14.1
AD0  (1 unrouted)
AD1  (1 unrouted)
AD2  (1 unrouted)
AVREF  (2 unrouted)
AVREFL  (3 unrouted)
BD+  (1 unrouted)
  Top 0.406: Z4.2 6.04,22.23 J3.P3
BD-  (1 unrouted)
  Top 0.406: J3.P2 4.12,22.86 6.86,22.86 7.11,23.11 7.11,24.38 8.59,25.86 Z3.2
CANRX0  (1 unrouted)
CANTX0  (1 unrouted)
CANTX1/IO  (1 unrouted)
D+
  Top 0.305: U1.37 45.45,36.07 40.64,36.07 40.28,35.71 R6.1
D-
  Top 0.305: R5.1 45.01,34.87 45.47,34.42 U1.38
DAC0(CANRX1)  (1 unrouted)
DAC1  (1 unrouted)
DTR
  Top 0.406: R18.1 20.57,12.64 20.57,13.84 18.44,15.98 IC6.13
GND  (via drill 0.6)  (72 unrouted)
  Top 0.305: R8.1 42.48,29.08 C9.1 42.48,33.02 C25.2 | C15.1 42.56,23.62 | 42.56,23.62 42.56,22.5 C6.1 42.61,20.07 C4.1 | U1.58 46,24.41 45.47,23.88 45.47,23.75 45.34,23.62 42.56,23.62
  Top 0.406: J3.P$2 Z3.1 6.6,25.99 6.6,27.69 8.48,29.57 L.C ON.C 9.49,27.36 | J3.P$2 J3.S3 | J3.S3 J3.P$1 3.83,24.59 | J3.P$4 2.79,24.59 | 2.79,24.59 2.92,24.59 | 3.83,24.59 J3.P$2 | J3.P$8 3.2,18.72 2.54,18.72 | 2.54,18.72 J3.P$5 1.45,18.92 J3.S2 1.35,18.92 J3.P$6 | 2.79,24.59 2.74,24.59 J3.S5 J3.S6 2.54,20.07 2.54,18.72 | J3.P$4 2.96,27.04 C28.2 | J3.P5 J3.P$7 J3.S4 J3.P$8 | C39.2 6.24,19.61 J3.P$8 | 3.83,24.59 2.92,24.59 | 2.92,24.59 3.05,24.71 J3.S3 | J3.P$4 2.06,26.14 2.11,26.14 1.7,25.73 J3.P$3 1.35,25.53 J3.S1 | 8.79,21.64 Z4.1 | Z4.1 7.5,20.32 6.99,20.32 6.72,20.05 C39.2 | 14.76,20.24 15.72,20.24 IC6.3 17.27,20.27 18.03,19.51 IC6.33 18.19,19.74 18.49,20.04 18.49,21.9 IC6.28 | 14.76,20.24 14.25,20.75 C40.2 | 14.76,20.24 14.76,20.1 C36.2 12.1,19.01 | Z4.1 8.89,21.71 v8.89,23.11 | v11.94,19.18 12.1,19.01 | 12.1,19.01 12.06,18.97 12.06,16.13 | 12.06,16.13 12.06,15.75 11.22,14.9 Y4.2 10.7,13.47 C37.2 | Y4.4 6.72,18.43 C39.2 | IC10.3 13.34,15.14 13.34,16 13.21,16.13 12.06,16.13
  Bottom 0.406: v8.89,23.11 9.4,23.62 11.05,23.37 11.94,22.48 v11.94,19.18
JTAG_RESET  (2 unrouted)
JTAG_TCK  (2 unrouted)
JTAG_TDI  (2 unrouted)
JTAG_TDO  (1 unrouted)
JTAG_TMS  (2 unrouted)
L13  (2 unrouted)
MASTER-RESET  (3 unrouted)
MISO2
  Top 0.406: ICSP1.1 23.37,16.26 22.1,16.26 20.64,17.72 IC6.17
MOSI2
  Top 0.406: IC6.16 21.75,15.24 24.38,15.24 25.7,13.92 ICSP1.4
N$1  (1 unrouted)
N$2
  Top 0.406: RN3.3 13.16,30.48 12.45,30.48 11.59,29.62 L.A
N$3
  Top 0.406: RN3.4 13.21,29.73 13.21,28.7 12.19,27.69 ON.A
N$4
  Top 0.406: R15.2 15.35,10.86 RX1.A
N$5  (1 unrouted)
N$7
  Top 0.305: U1.53 46.59,26.92 45.59,26.92 45.24,26.57 R4.1
N$11  (1 unrouted)
N$12  (1 unrouted)
N$13  (3 unrouted)
N$14
  Top 0.406: R14.2 16.34,9.53 17.78,9.53 18.85,10.59 TX1.A
N$15  (2 unrouted)
N$16  (2 unrouted)
N$17  (2 unrouted)
N$18  (2 unrouted)
N$19  (2 unrouted)
N$20  (2 unrouted)
N$21  (2 unrouted)
N$22  (2 unrouted)
N$54
  Top 0.406: RN3.1 12.7,32.66 12.7,33.27 12.65,33.33 RX.A
N$55
  Top 0.406: RN3.2 13.11,31.45 TX.A
PWM2  (1 unrouted)
PWM3  (1 unrouted)
PWM5  (1 unrouted)
PWM6  (1 unrouted)
PWM13  (1 unrouted)
RD+  (1 unrouted)
RD-  (1 unrouted)
RESET2  (via drill 0.6)  (1 unrouted)
  Top 0.305: ICSP1.5 24.89,12.7 27.94,12.7 28.73,13.49 D2.A
  Top 0.406: ICSP1.5 22.48,12.47 v22.48,12.57 | v22.48,21.59 22.35,21.72 21.97,21.72 21.51,21.26 IC6.24
  Bottom 0.406: v22.48,12.57 v22.48,21.59
RESET_CMD  (1 unrouted)
RX  (3 unrouted)
  Top 0.406: IC10.4 13.39,13.38 13.39,13.41
RXL  (1 unrouted)
RXL-U2
  Top 0.406: RX1.C 16.94,13.08 IC6.10
SCK2
  Top 0.406: IC6.15 19.43,15.88 21.39,13.92 ICSP1.3
SS0/PWM10  (1 unrouted)
SS1/PWM4  (2 unrouted)
TX  (3 unrouted)
TXL  (1 unrouted)
TXL-U2
  Top 0.406: TX1.C 17.65,14.13 17.65,16.38 17.44,16.6 IC6.11
USBVCCU2  (1 unrouted)
  Top 0.406: C28.1 4.06,29.91 4.06,30.99 3.45,31.6 F2.1
VBG  (1 unrouted)
  Top 0.305: U1.40 44.42,33.41 C25.1
VDDANA  (3 unrouted)
VDDOUT  (13 unrouted)
VDDOUTMI  (2 unrouted)
  Top 0.305: U1.41 45.48,32.91 45.34,32.77 45.34,32.38 44.58,31.62 44.58,31.36 C9.2
VDDPLL  (3 unrouted)
VUCAP  (1 unrouted)
XIN  (2 unrouted)
XIN32  (2 unrouted)
XOUT  (2 unrouted)
XOUT32  (2 unrouted)
XT1
  Top 0.406: IC6.1 14.26,22.73 13.72,22.73 13.16,23.29 R9.1 12.79,23.79 11.94,24.64 10.29,24.64 9.91,24.26 9.91,20.61 C39.1 8.43,19.13 9.65,17.91 9.65,16.15 Y4.1
XT2
  Top 0.406: R9.2 11.06,23.27 11.06,22.45 | 11.06,22.45 C40.1 11.06,20.46 10.54,19.94 10.54,16.91 Y4.3 | IC6.2 15.72,20.78 15.29,20.78 14.22,21.84 11.94,21.84 11.33,22.45 11.06,22.45
XVCC  (via drill 0.6)
  Top 0.406: F2.2 4.57,35.38 v4.57,34.8 | v5.59,23.88 5.26,23.55 J3.P1
  Bottom 0.406: v4.57,34.8 4.57,26.67 5.59,25.65 v5.59,23.88

### Text on the board
tNames: 5V | GND | SCL1 | SDA1 | AREF | PWM | TX | RX | TX0 | RX0 | TX1 | RX1 | TX2 | RX3 | SDA | SCL | 1 | MADE IN | ITALY | DIGITAL | Arduino | DUE | ANALOG IN | GND | IOREF | RESET | 3V3 | 5V | GND | VIN
ReferenceLC: PC2 | PC1